# EAGLE schematic OpenLux-v2 (EAGLE 6.4)
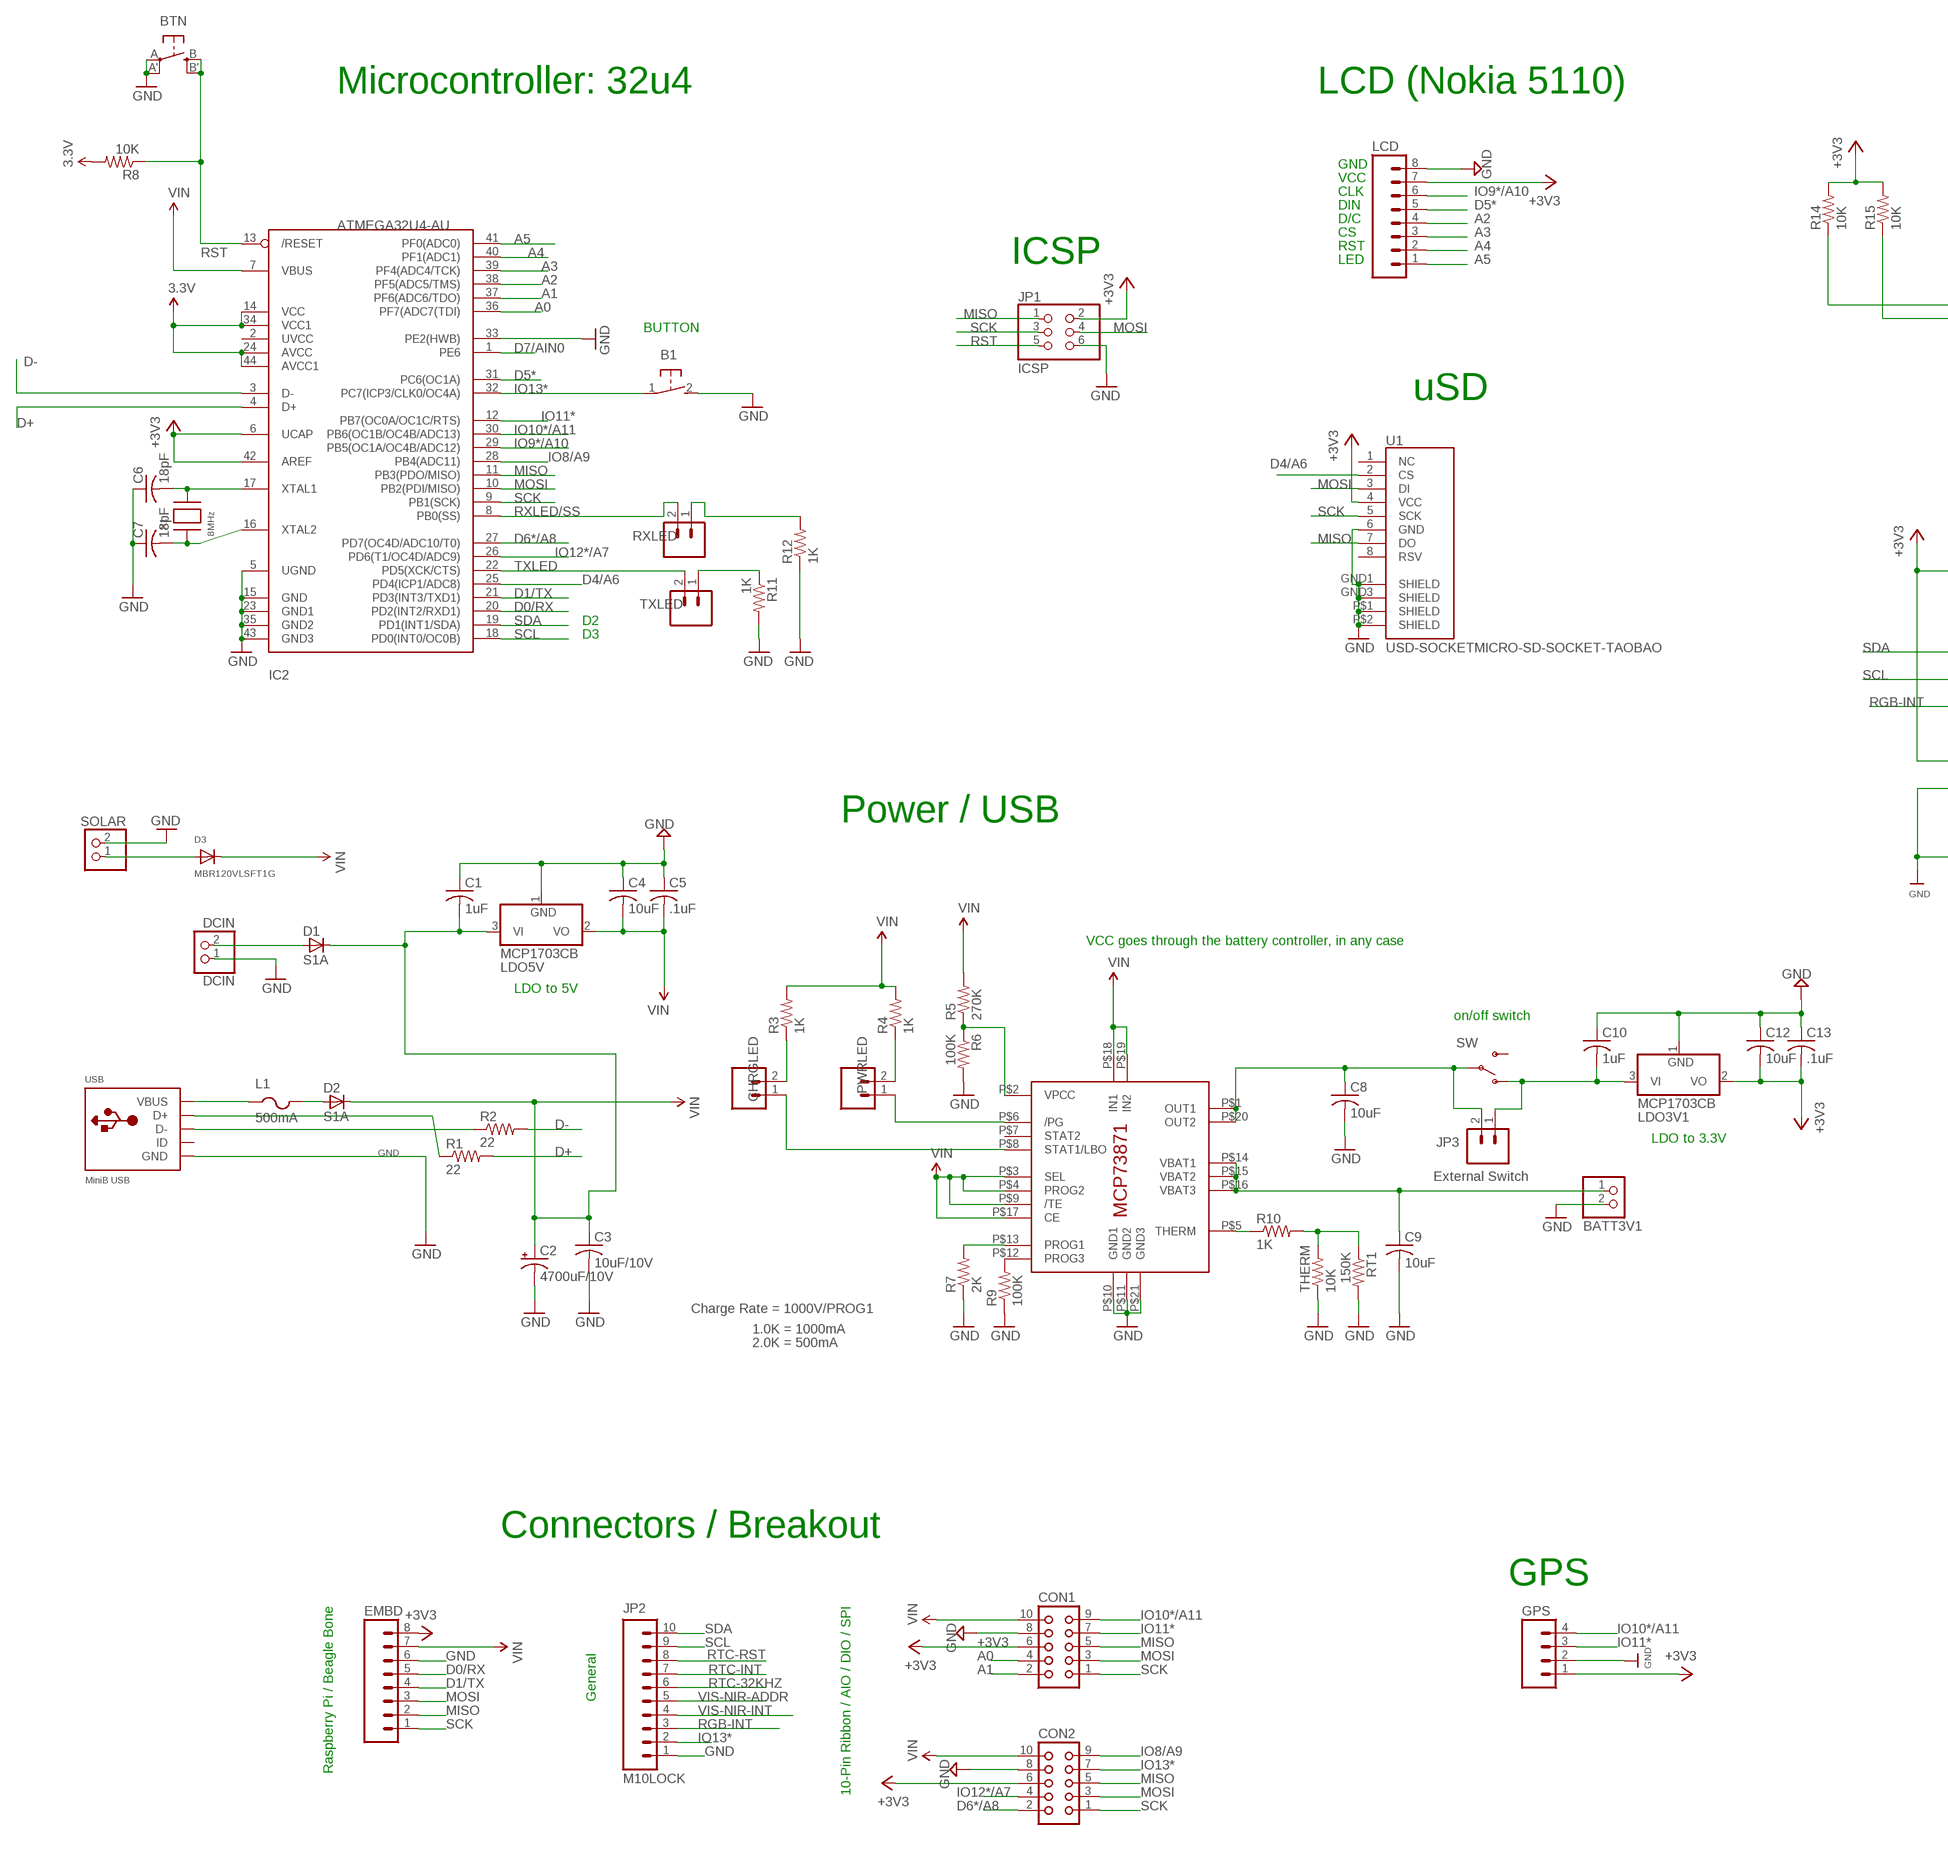
[diagram p0: schematic, sheet 1, part 1 of 2]
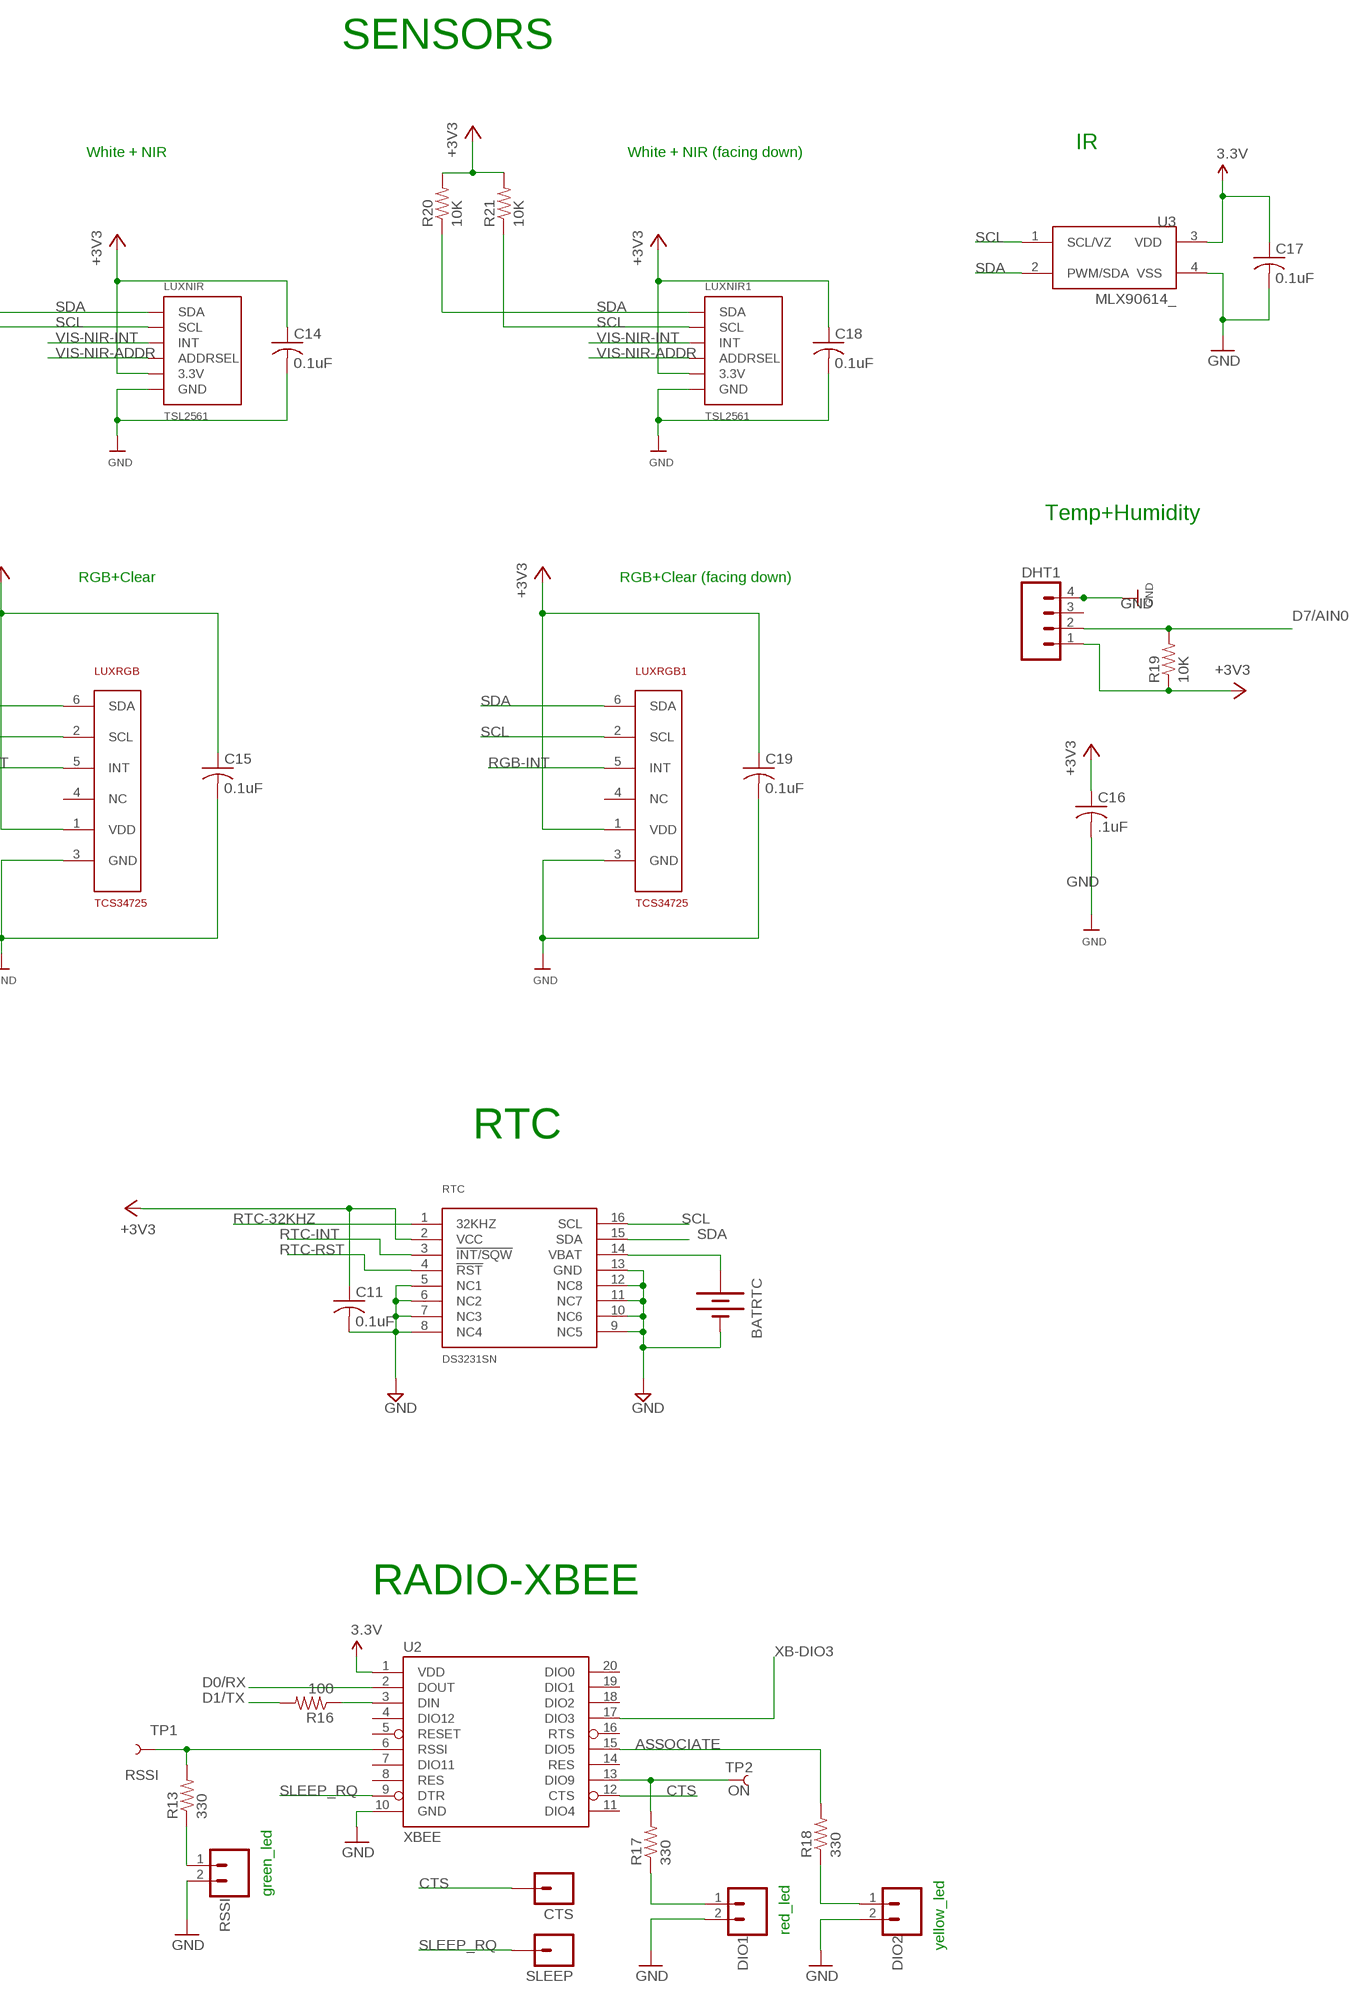
[diagram p1: schematic, sheet 1, part 2 of 2]

## Parts
B1  31-XX  [B3F-31XX]
BATRTC  BATTERYBATTERY_12MM_SMT  [BATTCON_12MM_SMT]
BATT3V1  JST_2PIN-SMT-RA  [JST-PH-2-SMT-RA]
BTN  EVQQ2  [EVQ-Q2]
C1  1uF  C-USC0805  [C0805]
C2  4700uF/10V  CPOL-USE5-13  [E5-13]
C3  10uF/10V  C-USC0805  [C0805]
C4  10uF  C-USC0805  [C0805]
C5  .1uF  C-USC0805  [C0805]
C6  18pF  C-USC0805  [C0805]
C7  18pF  C-USC0805  [C0805]
C8  10uF  C-USC0805  [C0805]
C9  10uF  C-USC0805  [C0805]
C10  1uF  C-USC0805  [C0805]
C11  0.1uF  C-USC0805  [C0805]
C12  10uF  C-USC0805  [C0805]
C13  .1uF  C-USC0805  [C0805]
C14  0.1uF  C-USC0805  [C0805]
C15  0.1uF  C-USC0805  [C0805]
C16  .1uF  C-USC0805  [C0805]
C17  0.1uF  C-USC0805  [C0805]
C18  0.1uF  C-USC0805  [C0805]
C19  0.1uF  C-USC0805  [C0805]
CHRGLED  M02PTH  [1X02]
CON1  CON10L  [CON10L]
CON2  CON10L  [CON10L]
CTS  M01PTH  [1X01]
D1  S1A  DIODE-DO-214AC  [DO-214AC]
D2  S1A  DIODE-DO-214AC  [DO-214AC]
D3  MBR120VLSFT1G  DIODESOD-123  [SOD-123]
DCIN  DCIN  HEADER-1X2  [1X02_OVAL]
DHT1  M04LOCK  [1X04_LOCK]
DIO1  M02PTH  [1X02]
DIO2  M02PTH  [1X02]
EMBD  M08LOCK  [1X08_LOCK]
GPS  M04LOCK  [1X04_LOCK]
IC1  MCP73871  [QFN20_4MM]
IC2  ATMEGA32U4-AU  [TQFP44]
JP1  ICSP  PINHD-2X3  [2X03]
JP2  M10LOCK  [1X10_LOCK]
JP3  External Switch  M02PTH  [1X02]
L1  500mA  PTCFUSE-1206  [R1206]
LCD  M08LOCK  [1X08_LOCK]
LDO3V1  MCP1703CB  [SOT23]
LDO5V  MCP1703CB  [SOT23]
LUXNIR  TSL2561  [TSL2561_FN@1]
LUXNIR1  TSL2561  [TSL2561_FN@1]
LUXRGB  TCS34725  [DFN-6]
LUXRGB1  TCS34725  [DFN-6]
PWRLED  M02PTH  [1X02]
R1  22  R-US_R0805  [R0805]
R2  22  R-US_R0805  [R0805]
R3  1K  R-US_R0805  [R0805]
R4  1K  R-US_R0805  [R0805]
R5  270K  R-US_R0805  [R0805]
R6  100K  R-US_R0805  [R0805]
R7  2K  R-US_FLIPFLOP  [0805-THM]
R8  10K  R-US_R0805  [R0805]
R9  100K  R-US_R0805  [R0805]
R10  1K  R-US_M0805  [M0805]
R11  1K  R-US_R0805  [R0805]
R12  1K  R-US_R0805  [R0805]
R13  330  R-US_R0805  [R0805]
R14  10K  R-US_R0805  [R0805]
R15  10K  R-US_R0805  [R0805]
R16  100  R-US_R0805  [R0805]
R17  330  R-US_R0805  [R0805]
R18  330  R-US_R0805  [R0805]
R19  10K  R-US_R0805  [R0805]
R20  10K  R-US_R0805  [R0805]
R21  10K  R-US_R0805  [R0805]
RSSI  M02PTH  [1X02]
RT1  150K  R-US_R0805  [R0805]
RTC  DS3231SN  [SO16W]
RXLED  M02PTH  [1X02]
SLEEP  M01PTH  [1X01]
SOLAR  JST_2PIN-SMT-RA  [JST-PH-2-SMT-RA]
SW  SPDT  SWITCH-SPSTSMD2  [SWITCH-SPDT-SMD]
THERM  10K  R-US_FLIPFLOP  [0805-THM]
TP1  RSSI  TEST-POINT3X5  [PAD.03X.05]
TP2  ON  TEST-POINT3X5  [PAD.03X.05]
TXLED  M02PTH  [1X02]
U1  USD-SOCKETMICRO-SD-SOCKET-TAOBAO  [MICRO-SD-SOCKET-TAOBAO]
U2  XBEE  XBEE-1B3  [XBEE-SMD]
U3  MLX90614_  [TO-39]
USB  MiniB USB  USBMINIBLARGE  [USB-MINIB_LARGER]
X1  8MHz  XTALNX5032  [NX5032]

## Nets
3.3V [vcc]: C17.1 U2.1(VDD) U3.3(VDD)
+3V3: C11.1 C12.2 C13.2 C14.1 C15.1 C16.1 C18.1 C19.1 CON1.6 CON2.6 DHT1.1 EMBD.8 GPS.1 IC2.6(UCAP) IC2.42(AREF) JP1.2 LCD.7 LDO3V1.2(VO) LUXNIR1.VDD(3.3V) LUXNIR.VDD(3.3V) LUXRGB1.1(VDD) LUXRGB.1(VDD) R14.2 R15.2 R19.1 R20.2 R21.2 RTC.2(VCC) U1.4(VCC)
A0: CON1.4 IC2.36(PF7(ADC7(TDI))
A1: CON1.2 IC2.37(PF6(ADC6/TDO))
A2: IC2.38(PF5(ADC5/TMS)) LCD.4
A3: IC2.39(PF4(ADC4/TCK)) LCD.3
A4: IC2.40(PF1(ADC1)) LCD.2
A5: IC2.41(PF0(ADC0)) LCD.1
ASSOCIATE: R18.2 U2.15(DIO5)
BATT: BATT3V1.1 C9.1 IC1.P$14(VBAT1) IC1.P$15(VBAT2) IC1.P$16(VBAT3)
CTS: CTS.1 U2.12(CTS)
D0/RX: EMBD.5 IC2.20(PD2(INT2/RXD1)) U2.2(DOUT)
D1/TX: EMBD.4 IC2.21(PD3(INT3/TXD1)) R16.2
D4/A6: IC2.25(PD4(ICP1/ADC8)) U1.2(CS)
D5*: IC2.31(PC6(OC1A)) LCD.5
D6*/A8: CON2.2 IC2.27(PD7(OC4D/ADC10/T0))
D7/AIN0: DHT1.2 IC2.1(PE6) R19.2
D+: IC2.4(D+) R1.2
D-: IC2.3(D-) R2.2
GND: B1.2(S) BATRTC.P$1(-) BATT3V1.2 BTN.A'(P1) BTN.A(P) C1.1 C2.- C3.2 C4.1 C5.1 C6.1 C7.1 C8.2 C9.2 C10.1 C11.2 C12.1 C13.1 C14.2 C15.2 C16.2 C17.2 C18.2 C19.2 CON1.8 CON2.8 DCIN.1 DHT1.4 DIO1.2 DIO2.2 EMBD.6 GPS.2 IC1.P$10(GND1) IC1.P$11(GND2) IC1.P$21(GND3) IC2.5(UGND) IC2.15(GND) IC2.23(GND1) IC2.33(PE2(HWB)) IC2.35(GND2) IC2.43(GND3) JP1.6 JP2.1 LCD.8 LDO3V1.1(GND) LDO5V.1(GND) LUXNIR1.VSS(GND) LUXNIR.VSS(GND) LUXRGB1.3(GND) LUXRGB.3(GND) R6.2 R7.1 R9.1 R11.2 R12.1 RSSI.2 RT1.2 RTC.5(NC1) RTC.6(NC2) RTC.7(NC3) RTC.8(NC4) RTC.9(NC5) RTC.10(NC6) RTC.11(NC7) RTC.12(NC8) RTC.13(GND) SOLAR.2 THERM.1 U1.6(GND) U1.GND1(SHIELD) U1.GND3(SHIELD) U1.P$1(SHIELD) U1.P$2(SHIELD) U2.10(GND) U3.4(VSS) USB.GND
IO8/A9: CON2.9 IC2.28(PB4(ADC11))
IO9*/A10: IC2.29(PB5(OC1A/OC4B/ADC12)) LCD.6
IO10*/A11: CON1.9 GPS.4 IC2.30(PB6(OC1B/OC4B/ADC13))
IO11*: CON1.7 GPS.3 IC2.12(PB7(OC0A/OC1C/RTS))
IO12*/A7: CON2.4 IC2.26(PD6(T1/OC4D/ADC9))
IO13*: B1.1(P) CON2.7 IC2.32(PC7(ICP3/CLK0/OC4A)) JP2.2
MISO: CON1.5 CON2.5 EMBD.2 IC2.11(PB3(PDO/MISO)) JP1.1 U1.7(DO)
MOSI: CON1.3 CON2.3 EMBD.3 IC2.10(PB2(PDI/MISO)) JP1.4 U1.3(DI)
N$1: BATRTC.P$2(+) RTC.14(VBAT)
N$2: R17.2 TP2.P$1 U2.13(DIO9)
N$3: R13.1 RSSI.1
N$4: R13.2 TP1.P$1 U2.6(RSSI)
N$5: R16.1 U2.3(DIN)
N$6: DIO1.1 R17.1
N$7: D1.A DCIN.2
N$8: C6.2 IC2.17(XTAL1) X1.P$2
N$9: C7.2 IC2.16(XTAL2) X1.P$1
N$11: R11.1 TXLED.1
N$12: R12.2 RXLED.1
N$13: L1.1 USB.VBUS
N$14: DIO2.1 R18.1
N$20: IC1.P$2(VPCC) R5.1 R6.1
N$21: IC1.P$6(/PG) PWRLED.1
N$22: D3.A SOLAR.1
N$24: D2.A L1.2
N$29: CHRGLED.1 IC1.P$8(STAT1/LBO)
N$30: CHRGLED.2 R3.1
N$32: PWRLED.2 R4.1
N$33: IC1.P$12(PROG3) R9.2
N$34: IC1.P$13(PROG1) R7.2
N$35: C8.1 IC1.P$1(OUT1) IC1.P$20(OUT2) JP3.2 SW.2(P)
N$36: IC1.P$5(THERM) R10.1
N$37: R10.2 RT1.1 THERM.2
N$41: R1.1 USB.D+
N$42: R2.1 USB.D-
N$44: C10.2 JP3.1 LDO3V1.3(VI) SW.1(O)
RGB-INT: JP2.3 LUXRGB1.5(INT) LUXRGB.5(INT)
RST: BTN.B'(S1) BTN.B(S) IC2.13(/RESET) JP1.5 R8.1
RTC-32KHZ: JP2.6 RTC.1(32KHZ)
RTC-INT: JP2.7 RTC.3(!INT/SQW)
RTC-RST: JP2.8 RTC.4(!RST)
RXLED/SS: IC2.8(PB0(SS)) RXLED.2
SCK: CON1.1 CON2.1 EMBD.1 IC2.9(PB1(SCK)) JP1.3 U1.5(SCK)
SCL: IC2.18(PD0(INT0/OC0B)) JP2.9 LUXNIR1.CLK(SCL) LUXNIR.CLK(SCL) LUXRGB1.2(SCL) LUXRGB.2(SCL) R15.1 R21.1 RTC.16(SCL) U3.1(SCL/VZ)
SDA: IC2.19(PD1(INT1/SDA)) JP2.10 LUXNIR1.DATA(SDA) LUXNIR.DATA(SDA) LUXRGB1.6(SDA) LUXRGB.6(SDA) R14.1 R20.1 RTC.15(SDA) U3.2(PWM/SDA)
SLEEP_RQ: SLEEP.1 U2.9(DTR)
TXLED: IC2.22(PD5(XCK/CTS)) TXLED.2
VCC: IC2.14(VCC) IC2.24(AVCC) IC2.34(VCC1) IC2.44(AVCC1) R8.2 ; supply symbol labelled 3.3V
VIN: C1.2 C2.+ C3.1 C4.2 C5.2 CON1.10 CON2.10 D1.C D2.C D3.C EMBD.7 IC1.P$3(SEL) IC1.P$4(PROG2) IC1.P$9(/TE) IC1.P$17(CE) IC1.P$18(IN1) IC1.P$19(IN2) IC2.7(VBUS) LDO5V.2(VO) LDO5V.3(VI) R3.2 R4.2 R5.2
VIS-NIR-ADDR: JP2.5 LUXNIR1.ADR(ADDRSEL) LUXNIR.ADR(ADDRSEL)
VIS-NIR-INT: JP2.4 LUXNIR1.INT LUXNIR.INT
XB-DIO3: U2.17(DIO3)
Unconnected: DHT1.3 IC1.P$7(STAT2) IC2.2(UVCC) LUXRGB1.4(NC) LUXRGB.4(NC) SW.3(S) U1.1(NC) U1.8(RSV) U2.4(DIO12) U2.5(RESET) U2.7(DIO11) U2.8(RES) U2.11(DIO4) U2.14(RES) U2.16(RTS) U2.18(DIO2) U2.19(DIO1) U2.20(DIO0) USB.ID

## Notes on the sheet
- SENSORS
- Microcontroller: 32u4 | LCD (Nokia 5110)
- IR
- GND | White + NIR | White + NIR (facing down)
- VCC
- CLK
- DIN
- D/C
- CS
- RST
- ICSP | LED
- BUTTON
- uSD
- Temp+Humidity
- RGB+Clear | RGB+Clear (facing down)
- D2
- D3
- Power / USB
- VCC goes through the battery controller, in any case
- LDO to 5V
- on/off switch
- RTC
- LDO to 3.3V
- Charge Rate = 1000V/PROG1
- 1.0K = 1000mA
- 2.0K = 500mA
- RADIO-XBEE
- Connectors / Breakout
- GPS
- Raspberry Pi / Beagle Bone | 10-Pin Ribbon / AIO / DIO / SPI
- General | green_led
- red_led
- yellow_led

## Library data of the parts
B1 = adafruit:31-XX: OMRON SWITCH Now with beefier pads!
BATRTC = SparkFunNew:BATTERY: Battery Holders Various common sizes : AA, AAA, 20mm coin cell and 12mm coin cell.
BATT3V1 SOLAR = adafruit:JST_2PIN: JST 2-Pin Connectors of various flavors SMT-RA (S2B-PH-SM4) 4UConnector #17311 SMT (B2B-PH-SM4) THM-RA (S2B-PH) THM (B2B-PH)
BTN = adafruit:EVQQ2: SMT 6mm switch, EVQQ2 series http://www.ladyada.net/library/eagle
C1 C3-C10 C12-C19 = adafruit:C-US: CAPACITOR, American symbol
C2 = adafruit:CPOL-US: POLARIZED CAPACITOR, American symbol
C11 = rcl:C-US: CAPACITOR, American symbol
CHRGLED DIO1 DIO2 JP3 PWRLED RSSI RXLED TXLED = SparkFun:M02: Header 2 Standard 2-pin 0.1" header. Use with straight break away headers (SKU : PRT-00116), right angle break away headers (PRT-00553), swiss pins (PRT-00743), machine pins (PRT-00117), and female headers (PRT-00115). Molex polarized connector foot print use with SKU : PRT-08233 with associated crimp pins and housings.
CON1 CON2 = con-harting:CON10L: CONNECTOR; OC_FARNELL: unknown; OC_NEWARK: unknown
CTS SLEEP = SparkFun:M01: Header 1 Standard 1-pin 0.1" header. Use with straight break away headers (SKU : PRT-00116), right angle break away headers (PRT-00553), swiss pins (PRT-00743), machine pins (PRT-00117), and female headers (PRT-00115).
D1 D2 = diode:DIODE-: DIODE
D3 = microbuilder:DIODE: Diode SMADIODE - SMA Surface Mount Package 20V 1A Schottky Diode Digikey (500mV @ 1A, 500uA Vr @ 20V): 641-1014-6-ND SOD-123 30V 500mA (430mV Vf, 130uA Vr @ 30V) Schottky Diode - Digikey: B0530W-FDICT-ND SOD-323 10V 570mA (380mV Vf, 3ns) Schottky Diode - Digikey: ZLLS410CT-ND 1N4148WS - 75V 150mA (1V Vf @ 10mA, 4ns) Simple Diode - Digikey: 1N4148WSFSCT-ND, Mouser: 512-1N4148WS SOD-523 30V 30mA Schottky Diode (RB751S-40TE61) - Digikey: RB751S-40TE61CT-ND SOT23-R/W - SOT23 Package (R = Solder Paste/Reflow Ovens, W = Hand-Soldering) BAT54Film 40V 300mA - Digikey: 497-7162-1-ND DO-1N4148 Through Hole Small Current Diode (any model)
DCIN = microbuilder:HEADER-1X2: PIN HEADER
DHT1 GPS = SparkFun-Connectors:M04: Header 4 Standard 4-pin 0.1" header. Use with straight break away headers (SKU : PRT-00116), right angle break away headers (PRT-00553), swiss pins (PRT-00743), machine pins (PRT-00117), and female headers (PRT-00115). Molex polarized connector foot print use with SKU : PRT-08231 with associated crimp pins and housings. 1MM SMD Version SKU: PRT-10208
EMBD LCD = SparkFun-Connectors:M08: Header 8 Standard 8-pin 0.1" header. Use with straight break away headers (SKU : PRT-00116), right angle break away headers (PRT-00553), swiss pins (PRT-00743), machine pins (PRT-00117), and female headers (PRT-00115).
IC1 = adafruit:MCP73871
IC2 = adaprog:ATMEGA32U4
JP1 = pinhead:PINHD-2X3: PIN HEADER
JP2 = SparkFun-Connectors:M10: Header 10 Standard 10-pin 0.1" header. Use with straight break away headers (SKU : PRT-00116), right angle break away headers (PRT-00553), swiss pins (PRT-00743), machine pins (PRT-00117), and female headers (PRT-00115).
L1 = adafruit:PTCFUSE: PTC fuses, resettable thermistors
LDO3V1 LDO5V = linear:MCP1703: 250 mA, 16V, Low Quiescent Current LDO Regulator Source: http://ww1.microchip.com/downloads/en/DeviceDoc/22049b.pdf
LUXNIR LUXNIR1 = microbuilder:TSL2561: TSL2561 Light-To-Digital Sensor Mouser Part Numbers: CS (obsolete): 856-TSL2561CS DFN (cheapest): 856-TSL2561FN
LUXRGB LUXRGB1 = dwbLibrary:TCS34725
R1-R21 RT1 THERM = adafruit:R-US_: RESISTOR, American symbol
RTC = comfile:DS3231SN
SW = SparkFun:SWITCH-SPST: SPST Switch Simple slide switch. Spark Fun Electronics SKU : COM-00102
TP1 TP2 = SparkFun:TEST-POINT
U1 = SparkFunNew:USD-SOCKET: microSD Socket Push-push type uSD socket. Schematic element and footprint production proven. Spark Fun Electronics SKU : PRT-00127. tDoc lines correctly indicate media card edge positions when inserting (unlocked, locked, depressed).
U2 = SparkFun:XBEE-1
U3 = SparkFun:MLX90614: Melexis IR Thermometer
USB = microbuilder:USB: USB Connectors USBMINIB - Surface Mount Female Mini-B USB Connector 4UConnector: 06564
X1 = adaprog:XTAL